# Altium schematic sheet RTC.SchDoc: uSDR schematic
size Letter; Author: Ye-sheng Kuo; CompanyName: Univ. of Michigan; Revision: 2.0; SheetNumber: 9; SheetTotal: 16
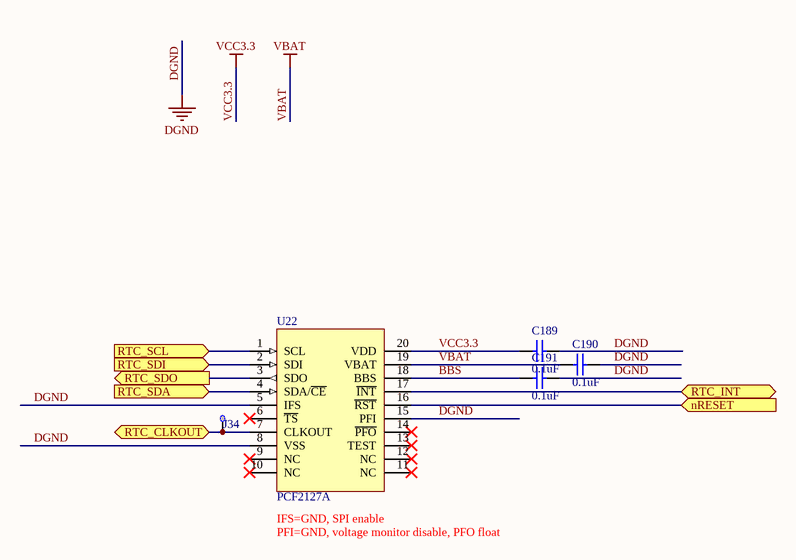
[diagram p0: RTC.SchDoc]

## Parts
C189  0.1uF  [0402]
C190  0.1uF  [0402]
C191  0.1uF  [0402]
J34  5004  [TestPoint]  (value not drawn)
U22  PCF2127A  [SOIC127P1030X265-20N]

## Ports
nRESET (in), RTC_CLKOUT, RTC_INT (bidir), RTC_SCL (in), RTC_SDA (in), RTC_SDI (in), RTC_SDO (out)

## Nets
DGND: C189.1 C190.1 C191.1 U22.5(IFS) U22.8(VSS) U22.15(PFI)
VBAT: C190.2 U22.19(VBAT)
VCC3.3: C189.2 U22.20(VDD)
BBS: C191.2 U22.18(BBS)
nRESET: U22.16(~{RST}) ; port nRESET
RTC_CLKOUT: J34.1(TB) U22.7(CLKOUT) ; port RTC_CLKOUT
RTC_INT: U22.17(~{INT}) ; port RTC_INT
RTC_SCL: U22.1(SCL) ; port RTC_SCL
RTC_SDA: U22.4(SDA/~{CE}) ; port RTC_SDA
RTC_SDI: U22.2(SDI) ; port RTC_SDI
RTC_SDO: U22.3(SDO) ; port RTC_SDO

Not connected (* = marked no-connect by the designer): U22 6(~{TS})* 9(NC)* 10(NC)* 11(NC)* 12(NC)* 13(TEST)* 14(~{PFO})*

## Notes on the sheet
- (near U22) IFS=GND, SPI enable
- PFI=GND, voltage monitor disable, PFO float
- Title
- Date:
- Author:
- Revision:
- Sheet
- of
- University of Michigan
- File:

## Library data of the parts
C189-C191 = Cap Semi: Capacitor (Semiconductor SIM Model); Published: 8-Jun-2000; LatestRevisionDate: 29-May-2009; LatestRevisionNote: IPC-7351 Footprint Added.; PackageReference: C1206; Publisher: Altium Limited; PackageDescription: Chip Capacitor; Value: 0.1uF
J34 = TestPoint: TEST POINT PC MINI .040"D YELLOW; Supplier 1: Digi-Key; Supplier Part Number 1: 5004K-ND; datasheet: http://mail.keyelco.com/ENG._DEPT/PDF%20CAT%20NO%20Drawings/5004.pdf
U22 = PCF2127A: IC REAL TIME CLK/CALENDAR 20SOIC; datasheet: http://www.nxp.com/documents/data_sheet/PCF2127A.pdf; Supplier 1: Digi-Key; Supplier Part Number 1: 568-4961-5-ND